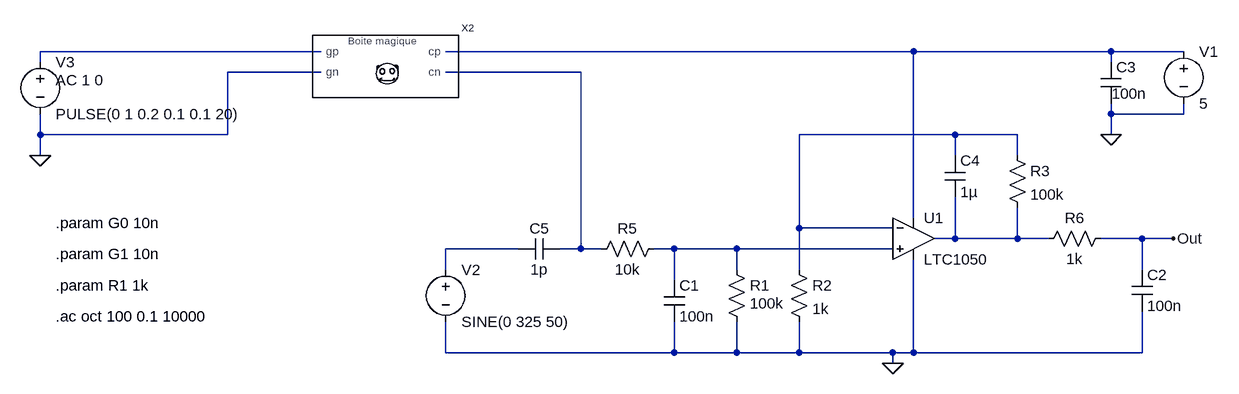
[diagram p0: schematic Amplificateur-Transimpedance.asc]
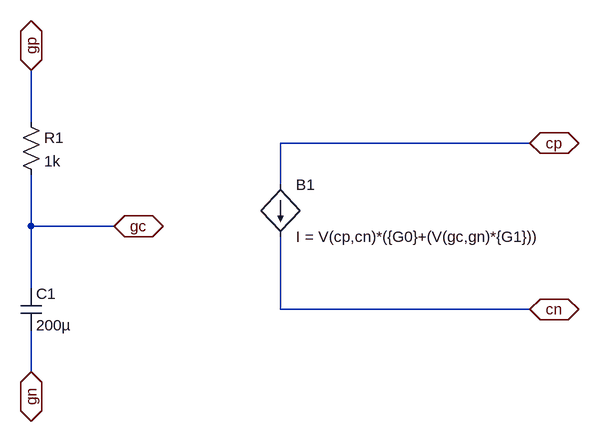
[diagram p1: sub-circuit symbole-capteur.asc]
Amplificateur-Transimpedance.asc, the LTspice schematic file:
Version 4
SHEET 1 2176 680
WIRE -560 -176 -992 -176
WIRE 352 -176 -368 -176
WIRE 656 -176 352 -176
WIRE 768 -176 656 -176
WIRE -992 -160 -992 -176
WIRE 656 -160 656 -176
WIRE -560 -144 -704 -144
WIRE -160 -144 -368 -144
WIRE 656 -80 656 -96
WIRE 768 -80 768 -96
WIRE 768 -80 656 -80
WIRE -992 -48 -992 -80
WIRE -704 -48 -704 -144
WIRE -704 -48 -992 -48
WIRE 416 -48 176 -48
WIRE 512 -48 416 -48
WIRE 656 -48 656 -80
WIRE -992 -16 -992 -48
WIRE 416 -16 416 -48
WIRE 512 -16 512 -48
WIRE 352 80 352 -176
WIRE 176 96 176 -48
WIRE 320 96 176 96
WIRE 416 112 416 48
WIRE 416 112 384 112
WIRE 512 112 512 64
WIRE 512 112 416 112
WIRE 560 112 512 112
WIRE 704 112 640 112
WIRE 752 112 704 112
WIRE -256 128 -368 128
WIRE -160 128 -160 -144
WIRE -160 128 -192 128
WIRE -128 128 -160 128
WIRE -16 128 -48 128
WIRE 80 128 -16 128
WIRE 320 128 80 128
WIRE -368 160 -368 128
WIRE 80 160 80 128
WIRE 176 160 176 96
WIRE 704 160 704 112
WIRE -16 176 -16 128
WIRE -368 288 -368 240
WIRE -16 288 -16 240
WIRE -16 288 -368 288
WIRE 80 288 80 240
WIRE 80 288 -16 288
WIRE 176 288 176 240
WIRE 176 288 80 288
WIRE 320 288 176 288
WIRE 352 288 352 144
WIRE 352 288 320 288
WIRE 704 288 704 224
WIRE 704 288 352 288
WIRE 320 304 320 288
FLAG 656 -48 0
FLAG 752 112 Out
FLAG -992 -16 0
FLAG 320 304 0
SYMBOL res 64 144 R0
WINDOW 3 36 68 Left 2
SYMATTR Value 100k
SYMATTR InstName R1
SYMBOL res 160 144 R0
SYMATTR InstName R2
SYMATTR Value 1k
SYMBOL res 496 -32 R0
SYMATTR InstName R3
SYMATTR Value 100k
SYMBOL res -32 112 R90
WINDOW 0 0 56 VBottom 2
WINDOW 3 32 56 VTop 2
SYMATTR InstName R5
SYMATTR Value 10k
SYMBOL res 656 96 R90
WINDOW 0 0 56 VBottom 2
WINDOW 3 32 56 VTop 2
SYMATTR InstName R6
SYMATTR Value 1k
SYMBOL cap -32 176 R0
SYMATTR InstName C1
SYMATTR Value 100n
SYMBOL cap 688 160 R0
SYMATTR InstName C2
SYMATTR Value 100n
SYMBOL cap 640 -160 R0
WINDOW 3 17 49 Left 2
SYMATTR Value 100n
SYMATTR InstName C3
SYMBOL cap 400 -16 R0
SYMATTR InstName C4
SYMATTR Value 1µ
SYMBOL voltage 768 -192 R0
WINDOW 123 0 0 Left 0
WINDOW 39 0 0 Left 0
SYMATTR InstName V1
SYMATTR Value 5
SYMBOL OpAmps\\LTC1050 352 48 R0
SYMATTR InstName U1
SYMBOL voltage -992 -176 R0
WINDOW 123 24 44 Left 2
WINDOW 39 0 0 Left 0
SYMATTR Value2 AC 1 0
SYMATTR InstName V3
SYMATTR Value PULSE(0 1 0.2 0.1 0.1 20)
SYMBOL cap -192 112 R90
WINDOW 0 0 32 VBottom 2
WINDOW 3 32 32 VTop 2
SYMATTR InstName C5
SYMATTR Value 1p
SYMBOL voltage -368 144 R0
WINDOW 123 0 0 Left 0
WINDOW 39 0 0 Left 0
SYMATTR InstName V2
SYMATTR Value SINE(0 325 50)
SYMBOL Symbole-Capteur -464 -160 R0
SYMATTR InstName X2
TEXT -968 232 Left 2 !.ac oct 100 0.1 10000
TEXT -968 88 Left 2 !.param G0 10n
TEXT -968 136 Left 2 !.param G1 10n
TEXT -968 184 Left 2 !.param R1 1k

symbole-capteur.asc, the sub-circuit schematic file:
Version 4
SHEET 1 880 680
WIRE -368 16 -368 -64
WIRE 400 48 16 48
WIRE 16 112 16 48
WIRE -368 176 -368 96
WIRE -240 176 -368 176
WIRE -368 272 -368 176
WIRE 16 304 16 192
WIRE 400 304 16 304
WIRE -368 400 -368 336
FLAG 400 48 cp
IOPIN 400 48 BiDir
FLAG 400 304 cn
IOPIN 400 304 BiDir
FLAG -368 -64 gp
IOPIN -368 -64 BiDir
FLAG -368 400 gn
IOPIN -368 400 BiDir
FLAG -240 176 gc
IOPIN -240 176 BiDir
SYMBOL bi 16 112 R0
SYMATTR InstName B1
SYMATTR Value I = V(cp,cn)*({G0}+(V(gc,gn)*{G1}))
SYMBOL res -384 0 R0
SYMATTR InstName R1
SYMATTR Value 1k
SYMBOL cap -384 272 R0
SYMATTR InstName C1
SYMATTR Value 200µ

The netlist it stands for:
* Amplificateur-Transimpedance.asc
R1 N007 0 100k
R2 N004 0 1k
R3 N004 N005 100k
R5 N007 N003 10k
R6 Out N005 1k
C1 N007 0 100n
C2 Out 0 100n
C3 N002 0 100n
C4 N004 N005 1µ
V1 N002 0 5
XU1 N007 N004 N002 0 N005 LTC1050  ; pins In+ In- V+ V- OUT
V3 N001 0 PULSE(0 1 0.2 0.1 0.1 20) AC 1 0
C5 N003 N006 1p
V2 N006 0 SINE(0 325 50)
XX2 N002 N003 N001 0 symbole-capteur

* block symbol definitions
.subckt symbole-capteur cp cn gp gn
B1 cp cn I = V(cp,cn)*({G0}+(V(gc,gn)*{G1}))
R1 gp gc 1k
C1 gc gn 200µ
.ends symbole-capteur

.ac oct 100 0.1 10000
.param G0 10n
.param G1 10n
.param R1 1k
.lib LTC.lib
.backanno
.end